# Altium schematic sheet dv_analog_interface_ch_src.SchDoc
size 209 x 297 mm; SheetNumber: 2; SheetTotal: 2; PageSetup: Record=PageOptions|CenterHorizontal=True|CenterVertical=True|PrintScale=1.00|XCorrection=1.00|YCorrection=1.00|PrintKind=1|BorderSize=5000000|LeftOffset=0|BottomOffset=0|Orientation=2|PaperLength=1000|PaperWidth=1000|Scale=100|PaperSource=15|PrintQuality=1200|MediaType=1|DitherType=10|PaperKind=A3|PrintScaleMode=1; Weight: -; ScaleFactor: -; NormInspection: Норм.Контр.
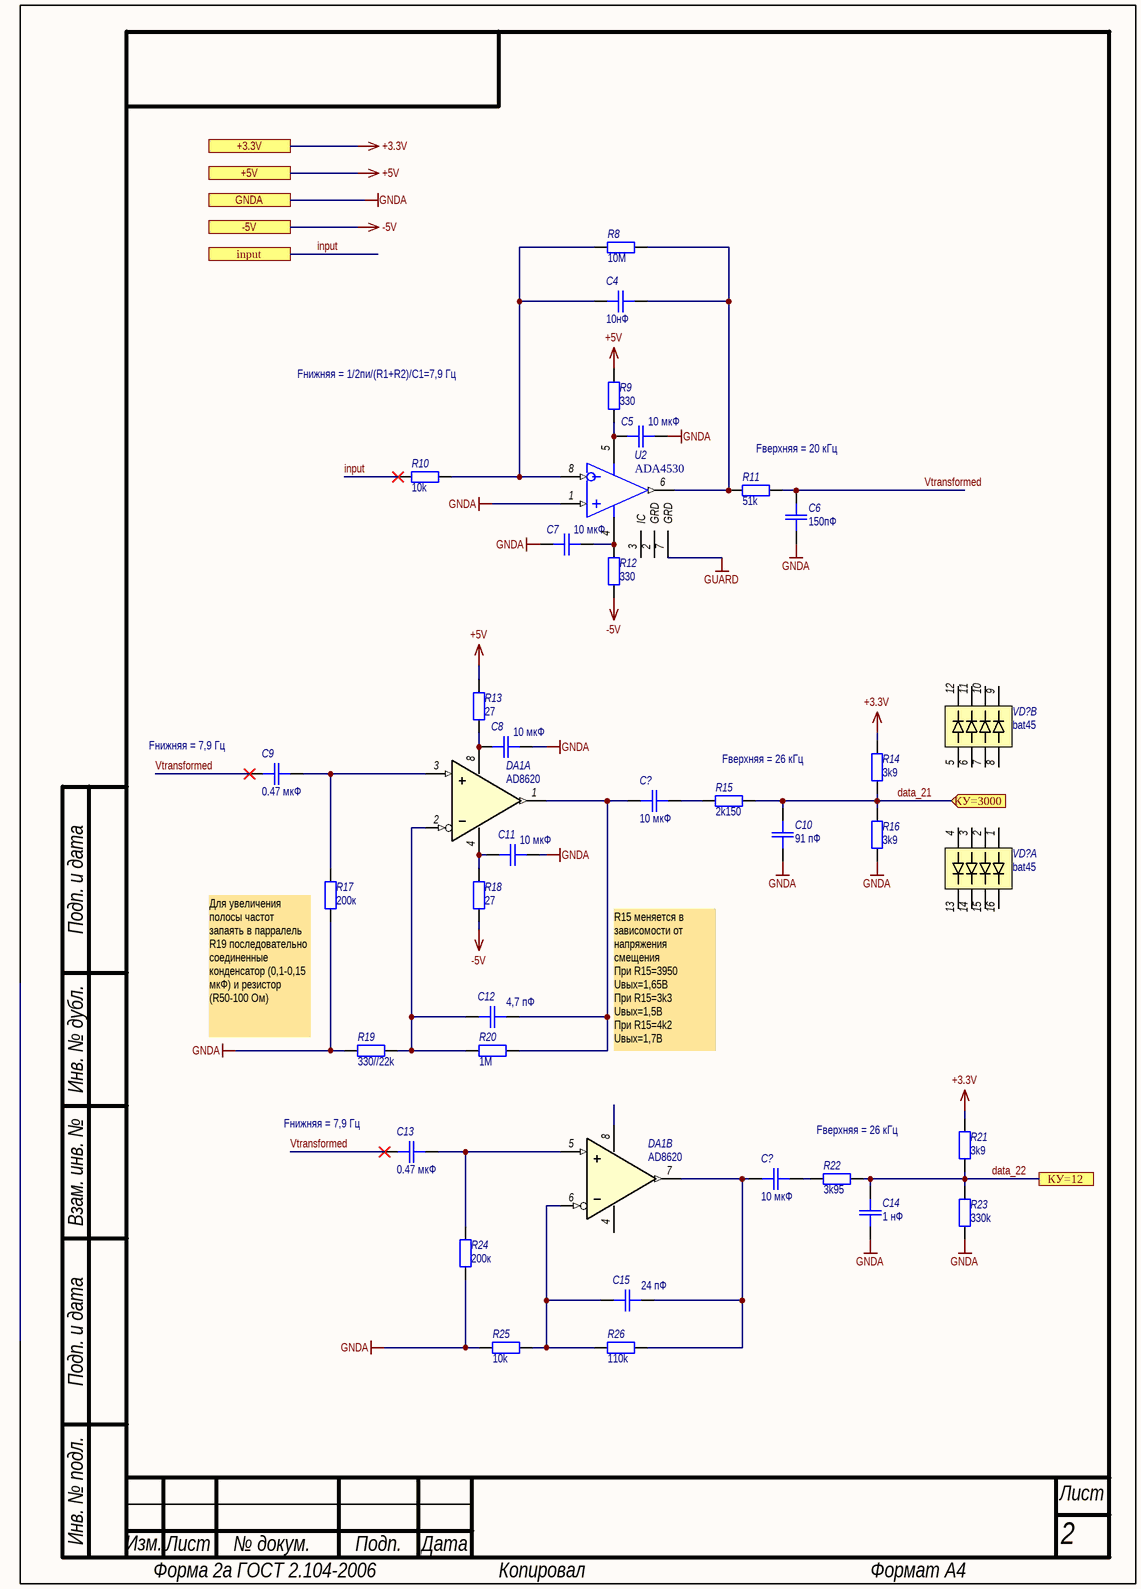
[diagram p0: dv_analog_interface_ch_src.SchDoc]

## Parts
(Parts that share a designator on the sheet are numbered #1, #2 ... from top to bottom, then left to right.)
C4  value 10нФ  [SMD_C0805]  (hidden comment: K10-79)
C5  value 10 мкФ  [SMD_C0805]  (hidden comment: K10-79)
C6  value 150пФ  [SMD_C0805]  (hidden comment: K10-79)
C7  value 10 мкФ  [SMD_C0805]  (hidden comment: K10-79)
C8  value 10 мкФ  [SMD_C0805]  (hidden comment: K10-79)
C9  value 0.47 мкФ  [SMD_C0805]  (hidden comment: K10-79)
C10  value 91 пФ  [SMD_C0805]  (hidden comment: K10-79)
C11  value 10 мкФ  [SMD_C0805]  (hidden comment: K10-79)
C12  value 4,7 пФ  [SMD_C0805]  (hidden comment: K10-79)
C13  value 0.47 мкФ  [SMD_C0805]  (hidden comment: K10-79)
C14  value 1 нФ  [SMD_C0805]  (hidden comment: K10-79)
C15  value 24 пФ  [SMD_C0805]  (hidden comment: K10-79)
C?#1  value 10 мкФ  [SMD_C0805]  (hidden comment: K10-79)
C?#2  value 10 мкФ  [SMD_C0805]  (hidden comment: K10-79)
DA1  Наименование: AD8620  [HO2.8-1B]  (hidden comment: 1487UD2U)  (parts A,B of 2)
R8  value 10M  [SMD_0805]  (hidden comment: OSM R1-12)
R9  value 330  [SMD_0805]  (hidden comment: OSM R1-12)
R10  value 10k  [SMD_0805]  (hidden comment: OSM R1-12)
R11  value 51k  [SMD_0805]  (hidden comment: OSM R1-12)
R12  value 330  [SMD_0805]  (hidden comment: OSM R1-12)
R13  value 27  [SMD_0805]  (hidden comment: OSM R1-12)
R14  value 3k9  [SMD_0805]  (hidden comment: OSM R1-12)
R15  value 2k150  [SMD_0805]  (hidden comment: OSM R1-12)
R16  value 3k9  [SMD_0805]  (hidden comment: OSM R1-12)
R17  value 200к  [SMD_0805]  (hidden comment: OSM R1-12)
R18  value 27  [SMD_0805]  (hidden comment: OSM R1-12)
R19  value 330//22k  [SMD_0805]  (hidden comment: OSM R1-12)
R20  value 1M  [SMD_0805]  (hidden comment: OSM R1-12)
R21  value 3k9  [SMD_0805]  (hidden comment: OSM R1-12)
R22  value 3k95  [SMD_0805]  (hidden comment: OSM R1-12)
R23  value 330k  [SMD_0805]  (hidden comment: OSM R1-12)
R24  value 200к  [SMD_0805]  (hidden comment: OSM R1-12)
R25  value 10k  [SMD_0805]  (hidden comment: OSM R1-12)
R26  value 110k  [SMD_0805]  (hidden comment: OSM R1-12)
U2  ADA4530  [SOIC-8]
VD?#1  bat45  [401.16-3]  (part B of 2)
VD?#2  Наименование: bat45  [401.16-3]  (hidden comment: 2DS627A OSM)  (part A of 2)

## Ports
+3.3V, +5V, -5V, GNDA, input, КУ=12, КУ=3000 (in)

## Nets
+3.3V: R14.2 R21.2 ; port +3.3V
+5V: R9.2 R13.2 ; port +5V
-5V: R12.1 R18.1 ; port -5V
GNDA: C5.1 C6.1 C7.2 C8.1 C10.1 C11.1 C14.1 R16.1 R17.1 R19.2 R23.1 R24.1 R25.2 U2.1(IN+) ; port GNDA
GUARD: U2.7(GRD)
data_21: C10.2 R14.1 R15.2 R16.2 ; port КУ=3000
data_22: C14.2 R21.1 R22.2 R23.2 ; port КУ=12
input: R10.1 ; port input
Vtransformed: C6.2 C9.2 C13.2 R11.2
NetC4_1: C4.1 R8.1 R10.2 U2.8(IN-)
NetC4_2: C4.2 R8.2 R11.1 U2.6(OUT)
NetC5_2: C5.2 R9.1 U2.5(V+)
NetC7_1: C7.1 R12.2 U2.4(V-)
NetC8_2: C8.2 DA1.8(Vss+) R13.1
NetC9_1: C9.1 DA1.3(In+) R17.2
NetC11_2: C11.2 DA1.4(Vss-) R18.2
NetC12_1: C12.1 C?#1.2 DA1.1(Out) R20.2
NetC12_2: C12.2 DA1.2(In-) R19.1 R20.1
NetC13_1: C13.1 DA1.5(In+) R24.2
NetC15_1: C15.1 C?#2.2 DA1.7(Out) R26.2
NetC15_2: C15.2 DA1.6(In-) R25.1 R26.1
NetC?#1_1: C?#1.1 R15.1
NetC?#2_1: C?#2.1 R22.1

Not connected (* = marked no-connect by the designer): U2 2(GRD) 3(IC); VD?#1 5(1E) 6(1F) 7(1G) 8(1H) 9(2G) 10(2G) 11(2F) 12(2E); VD?#2 1(1A) 2(1B) 3(1C) 4(1D) 13(2D) 14(2C) 15(2B) 16(2A)

## Notes on the sheet
- Fнижняя = 1/2пи/(R1+R2)/C1=7,9 Гц
- Fверхняя = 20 кГц
- (near C9) Fнижняя = 7,9 Гц
- Fверхняя = 26 кГц
- (near R17) Для увеличения полосы частот запаять в парралель R19 последовательно соединенные конденсатор (0,1-0,15 мкФ) и резистор (R50-100 Ом)
- R15 меняется в зависомости от напряжения смещения
  При R15=3950 Uвых=1,65В
  При R15=3k3 Uвых=1,5В
  При R15=4k2 Uвых=1,7В
- (near C13) Fнижняя = 7,9 Гц
- Подп. и дата
- Инв. № дубл.
- Взам. инв. №
- Инв. № подл.
- Изм.
- Лист
- № докум.
- Подп.
- Дата
- Форма 2а ГОСТ 2.104-2006
- Копировал
- Формат А4

## Library data of the parts
C4-C15 C?#1 C?#2 = Capacitor: Назначение: SMD-конденсатор; Наименование: К10-79; Потребление, Вт: 0; Напряжение: В; Точность: %
DA1 = 1487UD2U: Сдвоенный операционный усилитель; Потребление, Вт: 0,01; Назначение: Сдвоенный операционный усилитель
R8-R26 = Resistor: Наименование: ОСМ Р1-12; Назначение: SMD-резистор; Потребление, Вт: 0,001; Точность: %
U2 = ADA4530: Ultra-Low Bias Current Difet OpAmp; Назначение: Операционный усилитель; Потребление, Вт: 0,005; Наименование: ADA4530
VD?#1 VD?#2 = 2DS627A_2p: Диодная матрица; Потребление, Вт: 0,0; Назначение: Диодная матрица; ComponentLink1Description: DataSheet; ComponentLink1URL: https://www.integral.by/sites/default/files/pdf/2ds627a.pdf
  VD?#1: Наименование: bat45